# EAGLE design ds-8_clone_V2.1 (EAGLE 5.10)
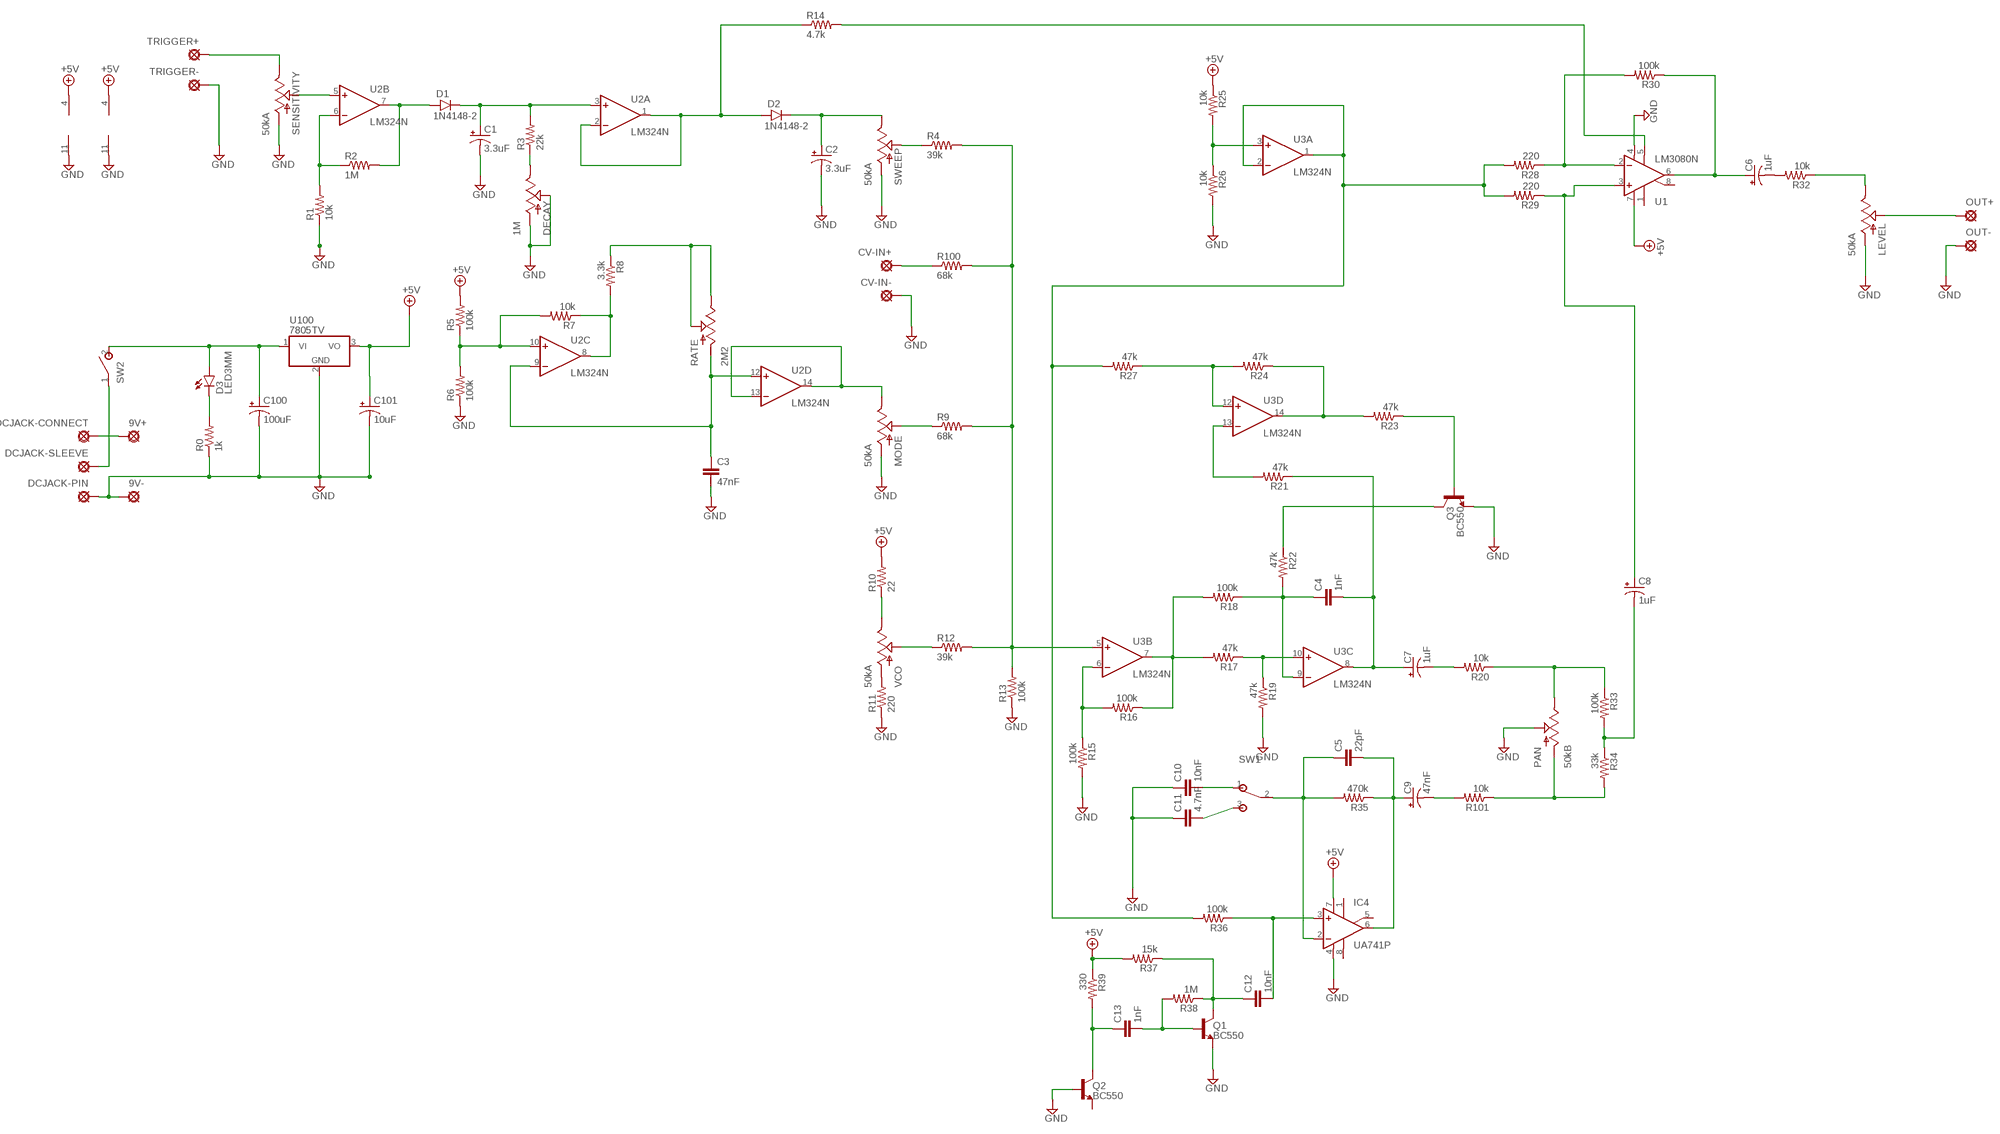
[diagram p0: schematic, sheet 1]

## Parts
9V+  Battery Adapter  PAD  [SQUARE]
9V-  Battery Adapter  PAD8  [OCTOGON]
C1  3.3uF  0501  [050_020_1]
C2  3.3uF  0501  [050_020_1]
C3  47nF  050X030_0251  [050X030_025]
C4  1nF  050X030_0251  [050X030_025]
C5  22pF  050X030_0251  [050X030_025]
C6  1uF  0501  [050_020_1]
C7  1uF  0501  [050_020_1]
C8  1uF  0501  [050_020_1]
C9  47nF  0501  [050_020_1]
C10  10nF  050X030_0251  [050X030_025]
C11  4.7nF  050X030_0251  [050X030_025]
C12  10nF  050X030_0251  [050X030_025]
C13  1nF  050X030_0251  [050X030_025]
C100  100uF  0501  [050_020_1]
C101  10uF  0501  [050_020_1]
CV-IN+  1/4" Mono Jack  PAD  [SQUARE]
CV-IN-  1/4" Mono Jack  PAD8  [OCTOGON]
D1  1N4148-2  [DO35-2]
D2  1N4148-2  [DO35-2]
D3  LED3MM  [LED3MM]
DCJACK-CONNECT  DC Jack  PAD  [SQUARE]
DCJACK-PIN  DC Jack  PAD8  [OCTOGON]
DCJACK-SLEEVE  DC Jack  PAD  [SQUARE]
DECAY  1M  POT-RV16AF-20  [POT_ALPHA_RV16AF-20]
IC4  UA741P  [DIL08]
LEVEL  50kA  POT-RV16AF-20  [POT_ALPHA_RV16AF-20]
MODE  50kA  POT-RV16AF-20  [POT_ALPHA_RV16AF-20]
OUT+  1/4" Mono Jack  PAD  [SQUARE]
OUT-  1/4" Mono Jack  PAD8  [OCTOGON]
PAN  50kB  POT-RV16AF-20  [POT_ALPHA_RV16AF-20]
Q1  BC550  [TO92-]
Q2  BC550  [TO92-]
Q3  BC550  [TO92-]
R0  1k  RESISTOR  [RESISTOR]
R1  10k  RESISTOR  [RESISTOR]
R2  1M  RESISTOR  [RESISTOR]
R3  22k  RESISTOR  [RESISTOR]
R4  39k  RESISTOR  [RESISTOR]
R5  100k  RESISTOR  [RESISTOR]
R6  100k  RESISTOR  [RESISTOR]
R7  10k  RESISTOR  [RESISTOR]
R8  3.3k  RESISTOR  [RESISTOR]
R9  68k  RESISTOR  [RESISTOR]
R10  22  RESISTOR  [RESISTOR]
R11  220  RESISTOR  [RESISTOR]
R12  39k  RESISTOR  [RESISTOR]
R13  100k  RESISTOR  [RESISTOR]
R14  4.7k  RESISTOR  [RESISTOR]
R15  100k  RESISTOR  [RESISTOR]
R16  100k  RESISTOR  [RESISTOR]
R17  47k  RESISTOR  [RESISTOR]
R18  100k  RESISTOR  [RESISTOR]
R19  47k  RESISTOR  [RESISTOR]
R20  10k  RESISTOR  [RESISTOR]
R21  47k  RESISTOR  [RESISTOR]
R22  47k  RESISTOR  [RESISTOR]
R23  47k  RESISTOR  [RESISTOR]
R24  47k  RESISTOR  [RESISTOR]
R25  10k  RESISTOR  [RESISTOR]
R26  10k  RESISTOR  [RESISTOR]
R27  47k  RESISTOR  [RESISTOR]
R28  220  RESISTOR  [RESISTOR]
R29  220  RESISTOR  [RESISTOR]
R30  100k  RESISTOR  [RESISTOR]
R32  10k  RESISTOR  [RESISTOR]
R33  100k  RESISTOR  [RESISTOR]
R34  33k  RESISTOR  [RESISTOR]
R35  470k  RESISTOR  [RESISTOR]
R36  100k  RESISTOR  [RESISTOR]
R37  15k  RESISTOR  [RESISTOR]
R38  1M  RESISTOR  [RESISTOR]
R39  330  RESISTOR  [RESISTOR]
R100  68k  RESISTOR  [RESISTOR]
R101  10k  RESISTOR  [RESISTOR]
RATE  2M2  POT-RV16AF-20  [POT_ALPHA_RV16AF-20]
SENSITIVITY  50kA  POT-RV16AF-20  [POT_ALPHA_RV16AF-20]
SW1  SPDT  SPDTPADS  [SPDT]
SW2  SPST  [SPST]
SWEEP  50kA  POT-RV16AF-20  [POT_ALPHA_RV16AF-20]
TRIGGER+  Piezo Cell / 1/4" Jack  PAD  [SQUARE]
TRIGGER-  Piezo Cell / 1/4" Jack  PAD8  [OCTOGON]
U1  LM3080N  [DIL08]
U2  LM324N  [DIL14]
U3  LM324N  [DIL14]
U100  7805TV  [TO220V]
VCO  50kA  POT-RV16AF-20  [POT_ALPHA_RV16AF-20]

## Nets
+9V: C101.+ IC4.7(V+) R5.2 R10.2 R25.1 R37.2 R39.1 U1.7(V+) U2.4(P:V+) U3.4(P:V+) U100.3(VO) ; supply symbol labelled +5V
C5: C5.1 IC4.2(-IN) R35.2 SW1.2(P)
GND: 9V-.1(PAD) C1.- C2.- C3.2 C10.1 C11.1 C100.- C101.- CV-IN-.1(PAD) DCJACK-PIN.1(PAD) DECAY.1(A) DECAY.2(S) IC4.4(V-) LEVEL.1(A) MODE.1(A) OUT-.1(PAD) PAN.2(S) Q1.1(E) Q2.2(B) Q3.1(E) R0.1 R1.1 R6.1 R11.1 R13.1 R15.2 R19.2 R26.2 SENSITIVITY.1(A) SWEEP.1(A) TRIGGER-.1(PAD) U1.4(V-) U2.11(P:V-) U3.11(P:V-) U100.2(GND)
N$1: SENSITIVITY.3(E) TRIGGER+.1(PAD)
N$2: DCJACK-SLEEVE.1(PAD) SW2.1(P)
N$3: SENSITIVITY.2(S) U2.5(B:+IN)
N$4: 9V+.1(PAD) DCJACK-CONNECT.1(PAD)
N$5: R1.2 R2.1 U2.6(B:-IN)
N$6: D1.A R2.2 U2.7(B:OUT)
N$7: C1.+ D1.C R3.2 U2.3(A:+IN)
N$8: D2.A R14.1 U2.1(A:OUT) U2.2(A:-IN)
N$9: DECAY.3(E) R3.1
N$11: R14.2 U1.5(OPT)
N$12: R4.1 SWEEP.2(S)
N$13: R25.2 R26.1 U3.3(A:+IN)
N$14: R28.1 R30.2 U1.2(-IN)
N$15: C8.+ R29.1 U1.3(+IN)
N$16: R27.2 R28.2 R29.2 R36.2 U3.1(A:OUT) U3.2(A:-IN)
N$17: CV-IN+.1(PAD) R100.1
N$18: C6.+ R30.1 U1.6(OUT)
N$19: R4.2 R9.2 R12.2 R13.2 R100.2 U3.5(B:+IN)
N$20: MODE.2(S) R9.1
N$21: R11.2 VCO.1(A)
N$22: R12.1 VCO.2(S)
N$23: C2.+ D2.C SWEEP.3(E)
N$24: R5.1 R6.2 R7.2 U2.10(C:+IN)
N$25: LEVEL.3(E) R32.1
N$26: R7.1 R8.2 U2.8(C:OUT)
N$27: LEVEL.2(S) OUT+.1(PAD)
N$28: R10.1 VCO.3(E)
N$29: R15.1 R16.2 U3.6(B:-IN)
N$30: R16.1 R17.2 R18.2 U3.7(B:OUT)
N$31: R17.1 R19.1 U3.10(C:+IN)
N$32: C4.1 R18.1 R22.2 U3.9(C:-IN)
N$33: C4.2 C7.+ R21.1 U3.8(C:OUT)
N$34: C7.- R20.2
N$35: PAN.3(E) R20.1 R33.1
N$36: C8.- R33.2 R34.1
N$37: MODE.3(E) U2.13(D:-IN) U2.14(D:OUT)
N$38: C9.- R101.2
N$39: C5.2 C9.+ IC4.6(OUT) R35.1
N$40: D3.K(C) R0.2
N$41: C10.2 SW1.1(O)
N$42: C12.2 IC4.3(+IN) R36.1
N$43: C11.2 SW1.3(S)
N$44: C12.1 Q1.3(C) R37.1 R38.1
N$45: C100.+ D3.A SW2.2(S) U100.1(VI)
N$46: C13.2 Q1.2(B) R38.2
N$47: C13.1 Q2.3(C) R39.2
N$48: Q3.3(C) R22.1
N$49: R21.2 U3.13(D:-IN)
N$50: Q3.2(B) R23.1
N$51: R23.2 R24.1 U3.14(D:OUT)
N$52: R24.2 R27.1 U3.12(D:+IN)
N$53: C6.- R32.2
N$55: R8.1 RATE.2(S) RATE.3(E)
N$56: C3.1 RATE.1(A) U2.9(C:-IN) U2.12(D:+IN)
R34: PAN.1(A) R34.2 R101.1
Unconnected: IC4.1(ON1) IC4.5(ON2) IC4.8(OPT) Q2.1(E) U1.1(ON1) U1.8(ON2)

## Library data of the parts
9V+ 9V- CV-IN+ CV-IN- DCJACK-CONNECT DCJACK-PIN DCJACK-SLEEVE OUT+ OUT- TRIGGER+ TRIGGER- = gm-supply:PAD: PAD use this package for pads with any purpose, including input, output, send or return various pad shapes: round, square, octogonal, long, and long offset
C1 C2 C6-C9 C100 C101 = gm-caps-electro-pol:050: 0.22 - 100uF Xicon values at Mouser.com: 10V: 10 - 100uF; 16V: 2.2 - 47uF; 25V: 0.47 - 47uF; 50V: 0.22 - 22uF
C3-C5 C10-C13 = gm-caps-ceramic:050X030_025: 47 - 120pF Xicon Ceramic Disc 2.5mm lead spacing
D1 D2 = gm-diodes:1N4148: Fast Switching Diode DO-35 glass case a.k.a. 1N914
D3 = gm-diodes:LED
DECAY LEVEL MODE PAN RATE SENSITIVITY SWEEP VCO = SparkFun:POT
IC4 = linear:*741: OP AMP
Q1-Q3 = gm-trans:BC550
R0 R1-R30 R32-R39 R100 R101 = 00_steve:RESISTOR
SW1 = gm-switches:SPDT: TOGGLE SWITCH Marquardt
SW2 = gm-switches:SPST
U1 = gm-ics:*3080: OP AMP
U2 U3 = linear:LM324: OP AMP
U100 = linear:78*: Positive VOLTAGE REGULATOR Source: http://cache.national.com/ds/LM/LM78L05.pdf http://www.fairchildsemi.com/ds/LM/LM7805.pdf

## Board
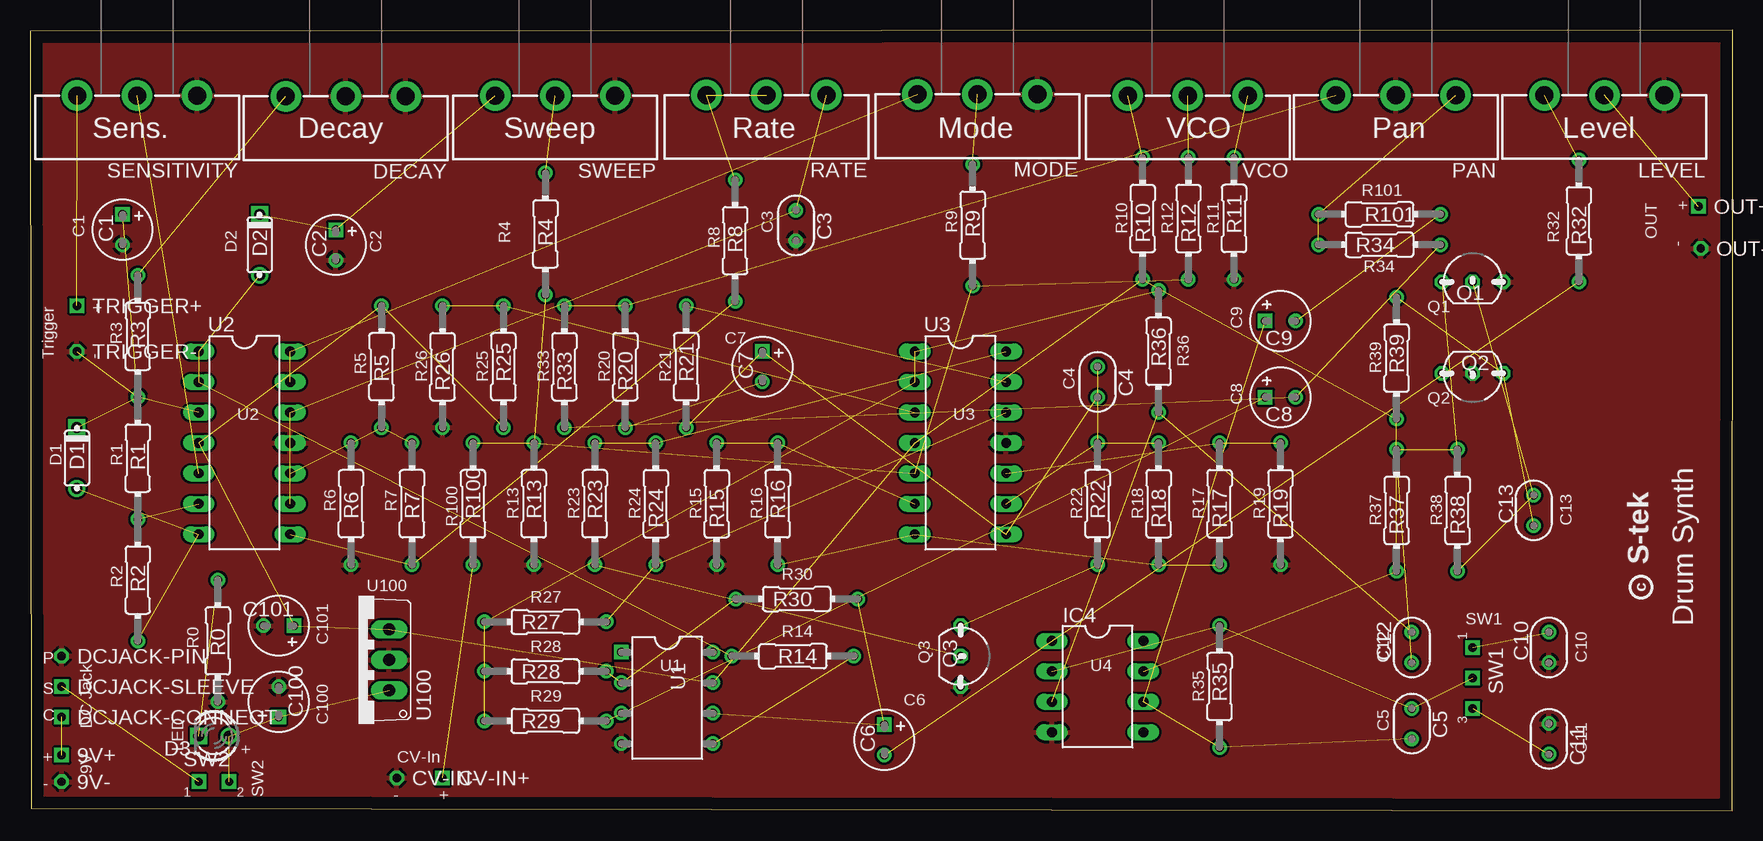
[diagram p1: board, top side]
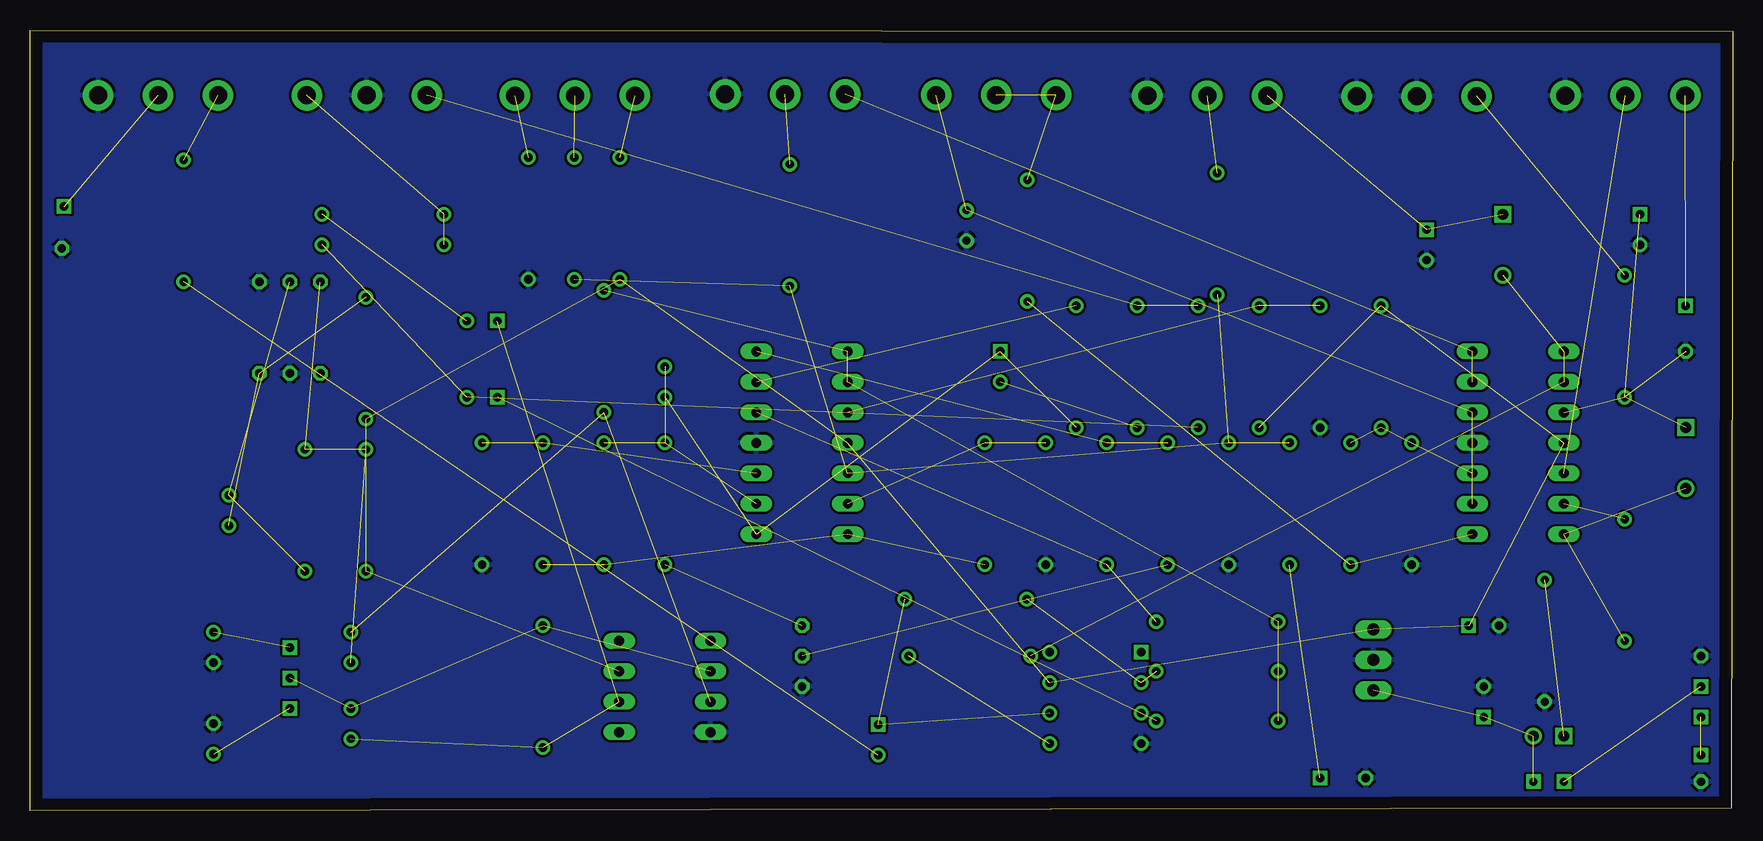
[diagram p2: board, bottom side, seen from below]

Size 141.92 x 65.09 mm. Coordinates in mm from the lower left corner, seen from the top.
Outline: 0.09,0.18 141.91,0 141.92,65.09 0,65.01 0.09,0.18
Copper layers (1*16): Top 0.035mm / dielectric 1.5mm / Bottom 0.035mm
Design rules "default": minimum track width 10mil, minimum drill 24mil, track to track 8mil, track to pad 8mil, pad to pad 8mil, via to via 8mil, smd to smd 8mil, copper to edge 40mil, drill to drill 8mil, minimum pad ring 10mil, minimum via ring 8mil, stop-mask expansion 4mil, vias tented up to drill 0mil, thermal gap 10mil

### Footprints (pad centres in the part's own frame; a part is rotated, then mirrored left to right if it is on the bottom)
SQUARE = drill 0.7 square: 1 0,0
OCTOGON = drill 0.7 octagon: 1 0,0
050_020_1 = drill 0.7 square: + -1.27,0 | drill 0.7 round: - 1.27,0
050X030_025 = drill 0.7 round: 1 -1.27,0; 2 1.27,0
DO35-2 = drill 0.9 round: A 2.54,0 | drill 0.9 square: C -2.54,0
LED3MM = drill 0.9 round: A -1.27,0 | drill 0.9 square: K 1.27,0
POT_ALPHA_RV16AF-20 = drill 1.5 pad 2.54 round: 1 -5,0; 2 0,0; 3 5,0
DIL08 = drill 0.813 long: 1 -3.81,-3.81; 2 -1.27,-3.81; 3 1.27,-3.81; 4 3.81,-3.81; 5 3.81,3.81; 6 1.27,3.81; 7 -1.27,3.81; 8 -3.81,3.81
TO92- = drill 0.7 octagon: 1 2.54,0; 2 0,0; 3 -2.54,0
RESISTOR = drill 0.7 round: 1 -5.08,0; 2 5.08,0
SPDT = drill 0.7 square: 1 -2.54,0; 2 0,0; 3 2.54,0
SPST = drill 0.7 square: 1 -1.27,0; 2 1.27,0
DIL08' = drill 0.7 square: 1 -3.81,-3.81 | drill 0.7 round: 2 -1.27,-3.81; 3 1.27,-3.81; 4 3.81,-3.81; 5 3.81,3.81; 6 1.27,3.81; 7 -1.27,3.81; 8 -3.81,3.81
DIL14 = drill 0.813 long: 1 -7.62,-3.81; 2 -5.08,-3.81; 3 -2.54,-3.81; 4 0,-3.81; 5 2.54,-3.81; 6 5.08,-3.81; 7 7.62,-3.81; 8 7.62,3.81; 9 5.08,3.81; 10 2.54,3.81; 11 0,3.81; 12 -2.54,3.81; 13 -5.08,3.81; 14 -7.62,3.81
TO220V = drill 1.016 long: 1 -2.54,-2.54; 2 0,-2.54; 3 2.54,-2.54

### Placement (x,y rotation side)
9V+  2.63,4.63 0 top
9V-  2.63,2.41 0 top
C1  7.71,48.44 270 top
C2  25.49,47.17 270 top
C3  63.85,48.8 270 top
C4  88.99,35.74 270 top
C5  115.18,7.25 270 top
C6  71.21,5.9 270 top
C7  61.05,37.01 270 top
C8  104.23,34.47 0 top
C9  104.23,40.82 0 top
C10  126.61,13.6 90 top
C11  126.61,5.98 270 top
C12  115.18,13.6 90 top
C13  125.34,25.03 90 top
C100  20.73,9.07 90 top
C101  20.73,15.42 180 top
CV-IN+  34.38,2.72 0 top
CV-IN-  30.57,2.72 0 top
D1  3.9,29.39 270 top
D2  19.14,47.17 270 top
D3  15.33,6.22 180 top
DCJACK-CONNECT  2.63,7.8 0 top
DCJACK-PIN  2.63,12.88 0 top
DCJACK-SLEEVE  2.63,10.34 0 top
DECAY  26.33,59.56 180 top
IC4  88.99,10.34 270 top
LEVEL  131.24,59.64 180 top
MODE  78.97,59.72 180 top
OUT+  139.07,50.37 0 top
OUT-  139.27,46.87 0 top
PAN  113.84,59.63 180 top
Q1  120.26,44.08 0 top
Q2  120.26,36.46 180 top
Q3  77.56,12.88 270 top
R0  15.65,14.15 90 top
R1  8.98,29.39 270 top
R2  8.98,19.23 270 top
R3  8.98,39.55 270 top
R4  42.96,48.09 270 top
R5  29.3,37.01 90 top
R6  26.76,25.58 90 top
R7  31.84,25.58 90 top
R8  58.77,47.53 270 top
R9  78.57,48.82 270 top
R10  92.75,49.37 270 top
R11  100.37,49.37 90 top
R12  96.56,49.37 270 top
R13  42,25.58 90 top
R14  63.59,12.88 0 top
R15  57.24,25.58 270 top
R16  62.32,25.58 90 top
R17  99.15,25.58 270 top
R18  94.07,25.58 270 top
R19  104.23,25.58 270 top
R20  49.62,37.01 270 top
R21  54.7,37.01 90 top
R22  88.99,25.58 90 top
R23  47.08,25.58 90 top
R24  52.16,25.58 270 top
R25  39.46,37.01 90 top
R26  34.38,37.01 270 top
R27  42.96,15.74 180 top
R28  42.96,11.61 180 top
R29  42.96,7.49 180 top
R30  63.91,17.65 180 top
R32  129.11,49.18 270 top
R33  44.54,37.01 270 top
R34  112.49,47.18 180 top
R35  99.15,10.34 90 top
R36  94.07,38.28 90 top
R37  113.91,25.03 270 top
R38  118.99,25.03 270 top
R39  113.91,37.73 90 top
R100  36.92,25.58 90 top
R101  112.49,49.72 0 top
RATE  61.39,59.67 180 top
SENSITIVITY  8.93,59.63 180 top
SW1  120.26,11.06 270 top
SW2  15.33,2.41 0 top
SWEEP  43.78,59.61 180 top
TRIGGER+  3.9,42.09 0 top
TRIGGER-  3.9,38.28 0 top
U1  LM3080N  [DIL08']  53.12,9.39 270 top
U2  17.87,30.66 270 top
U3  77.56,30.66 270 top
U100  27.4,12.57 90 top
VCO  96.5,59.63 180 top

### Tracks (layer width: path | path; a pad name or v marks a point on that pad's centre or on a via)
+9V  (10 unrouted)
C5  (3 unrouted)
GND  (1 unrouted)
  pour Bottom: 0.4,64.95 142.02,65.12 142.02,0.18 0.09,0.18 0.09,4.09 0,4.09 -0.04,64.72 -0.04,64.9
  pour Top: 0.76,64.68 142.33,64.68 142.33,18.85 142.11,18.85 142.11,0.49 -0.08,0.49 -0.08,3.29 -0.13,3.29 -0.13,64.72 0.72,64.72
N$1  (1 unrouted)
N$2  (1 unrouted)
N$3  (1 unrouted)
N$4  (1 unrouted)
N$5  (1 unrouted)
N$6  (2 unrouted)
N$7  (3 unrouted)
N$8  (3 unrouted)
N$9  (1 unrouted)
N$11  (1 unrouted)
N$12  (1 unrouted)
N$13  (2 unrouted)
N$14  (2 unrouted)
N$15  (2 unrouted)
N$16  (5 unrouted)
N$17  (1 unrouted)
N$18  (2 unrouted)
N$19  (5 unrouted)
N$20  (1 unrouted)
N$21  (1 unrouted)
N$22  (1 unrouted)
N$23  (2 unrouted)
N$24  (3 unrouted)
N$25  (1 unrouted)
N$26  (2 unrouted)
N$27  (1 unrouted)
N$28  (1 unrouted)
N$29  (2 unrouted)
N$30  (3 unrouted)
N$31  (2 unrouted)
N$32  (3 unrouted)
N$33  (3 unrouted)
N$34  (1 unrouted)
N$35  (2 unrouted)
N$36  (2 unrouted)
N$37  (2 unrouted)
N$38  (1 unrouted)
N$39  (3 unrouted)
N$40  (1 unrouted)
N$41  (1 unrouted)
N$42  (2 unrouted)
N$43  (1 unrouted)
N$44  (3 unrouted)
N$45  (3 unrouted)
N$46  (2 unrouted)
N$47  (2 unrouted)
N$48  (1 unrouted)
N$49  (1 unrouted)
N$50  (1 unrouted)
N$51  (2 unrouted)
N$52  (2 unrouted)
N$53  (1 unrouted)
N$55  (2 unrouted)
N$56  (3 unrouted)
R34  (2 unrouted)

### Text on the board
tPlace: Sens. | Decay | Sweep | Rate | Mode | VCO | Pan | Level | R101 | + | C1 | C3 | R9 | R10 | R12 | R11 | R4 | R8 | R32 | OUT | - | D2 | C2 | R34 | + | Q1 | C9 | R3 | C7 | Trigger | - | R36 | R5 | R26 | R25 | R33 | R20 | R21 | R39 | C4 | C8 | Q2 | U2 | U3 | D1 | R1 | R6 | R7 | R13 | R23 | R24 | R15 | R16 | R22 | R18 | R17 | R19 | R37 | R38 | C13 | R100 | S-tek | R30 | R2 | U100 | c | R27 | SW1 | Drum Synth | C101 | R14 | R0 | R28 | P | Q3 | C12 | C12 | C10 | U1 | U4 | S | R29 | C6 | R35 | C | DC Jack | C100 | C5 | LED | C11 | + | + | CV-In | 9V | - | SW2 | - | +